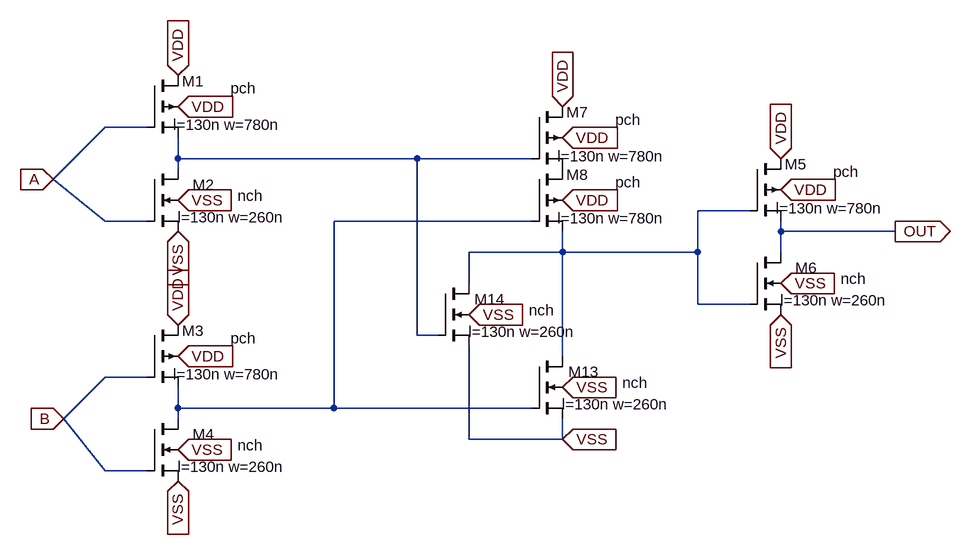
[diagram p0: schematic Or2.asc]
Or2.asc, the LTspice schematic file:
Version 4.1
SHEET 1 2700 680
WIRE 1440 -256 1376 -256
WIRE 1488 -208 1488 -240
WIRE 1856 -208 1488 -208
WIRE 2032 -208 1856 -208
WIRE 1488 -192 1488 -208
WIRE 1296 -176 1376 -256
WIRE 2368 -128 2288 -128
WIRE 1376 -112 1296 -176
WIRE 1440 -112 1376 -112
WIRE 2032 -112 1728 -112
WIRE 2416 -96 2416 -112
WIRE 2592 -96 2416 -96
WIRE 2080 -64 2080 -96
WIRE 2080 -64 1936 -64
WIRE 2288 -64 2288 -128
WIRE 2288 -64 2080 -64
WIRE 2416 -64 2416 -96
WIRE 1936 -16 1936 -64
WIRE 2288 16 2288 -64
WIRE 2368 16 2288 16
WIRE 1856 64 1856 -208
WIRE 1888 64 1856 64
WIRE 2080 96 2080 -64
WIRE 1440 128 1376 128
WIRE 1488 176 1488 144
WIRE 1728 176 1728 -112
WIRE 1728 176 1488 176
WIRE 2032 176 1728 176
WIRE 1312 192 1376 128
WIRE 1488 192 1488 176
WIRE 1936 224 1936 80
WIRE 2080 224 2080 192
WIRE 2080 224 1936 224
WIRE 1376 272 1312 192
WIRE 1440 272 1376 272
FLAG 1488 -336 VDD
IOPIN 1488 -336 In
FLAG 1488 -288 VDD
IOPIN 1488 -288 In
FLAG 2080 -288 VDD
IOPIN 2080 -288 In
FLAG 2080 -240 VDD
IOPIN 2080 -240 In
FLAG 2080 -144 VDD
IOPIN 2080 -144 In
FLAG 2416 -208 VDD
IOPIN 2416 -208 In
FLAG 2416 -160 VDD
IOPIN 2416 -160 In
FLAG 1488 48 VDD
IOPIN 1488 48 In
FLAG 1488 96 VDD
IOPIN 1488 96 In
FLAG 1488 -144 VSS
IOPIN 1488 -144 In
FLAG 1488 -96 VSS
IOPIN 1488 -96 In
FLAG 1488 240 VSS
IOPIN 1488 240 In
FLAG 1488 288 VSS
IOPIN 1488 288 In
FLAG 2080 144 VSS
IOPIN 2080 144 In
FLAG 2080 224 VSS
IOPIN 2080 224 In
FLAG 2416 -16 VSS
IOPIN 2416 -16 In
FLAG 2416 32 VSS
IOPIN 2416 32 In
FLAG 1936 32 VSS
IOPIN 1936 32 In
FLAG 1296 -176 A
IOPIN 1296 -176 In
FLAG 1312 192 B
IOPIN 1312 192 In
FLAG 2592 -96 OUT
IOPIN 2592 -96 Out
SYMBOL pmos4 1440 -336 R0
WINDOW 0 88 9 Right 2
WINDOW 3 168 20 Right 2
WINDOW 123 206 76 Right 2
SYMATTR InstName M1
SYMATTR Value pch
SYMATTR Value2 l=130n w=780n
SYMBOL nmos4 1440 -192 R0
WINDOW 0 104 24 Right 2
WINDOW 3 179 41 Right 2
WINDOW 123 213 74 Right 2
SYMATTR InstName M2
SYMATTR Value nch
SYMATTR Value2 l=130n w=260n
SYMBOL pmos4 1440 48 R0
WINDOW 0 88 9 Right 2
WINDOW 3 168 20 Right 2
WINDOW 123 206 76 Right 2
SYMATTR InstName M3
SYMATTR Value pch
SYMATTR Value2 l=130n w=780n
SYMBOL nmos4 1440 192 R0
WINDOW 0 104 24 Right 2
WINDOW 3 179 41 Right 2
WINDOW 123 213 74 Right 2
SYMATTR InstName M4
SYMATTR Value nch
SYMATTR Value2 l=130n w=260n
SYMBOL pmos4 2368 -208 R0
WINDOW 0 88 9 Right 2
WINDOW 3 168 20 Right 2
WINDOW 123 206 76 Right 2
SYMATTR InstName M5
SYMATTR Value pch
SYMATTR Value2 l=130n w=780n
SYMBOL nmos4 2368 -64 R0
WINDOW 0 104 24 Right 2
WINDOW 3 179 41 Right 2
WINDOW 123 213 74 Right 2
SYMATTR InstName M6
SYMATTR Value nch
SYMATTR Value2 l=130n w=260n
SYMBOL pmos4 2032 -288 R0
WINDOW 0 88 9 Right 2
WINDOW 3 168 20 Right 2
WINDOW 123 206 76 Right 2
SYMATTR InstName M7
SYMATTR Value pch
SYMATTR Value2 l=130n w=780n
SYMBOL pmos4 2032 -192 R0
WINDOW 0 88 9 Right 2
WINDOW 3 168 20 Right 2
WINDOW 123 206 76 Right 2
SYMATTR InstName M8
SYMATTR Value pch
SYMATTR Value2 l=130n w=780n
SYMBOL nmos4 2032 96 R0
WINDOW 0 104 24 Right 2
WINDOW 3 179 41 Right 2
WINDOW 123 213 74 Right 2
SYMATTR InstName M13
SYMATTR Value nch
SYMATTR Value2 l=130n w=260n
SYMBOL nmos4 1888 -16 R0
WINDOW 0 104 24 Right 2
WINDOW 3 179 41 Right 2
WINDOW 123 213 74 Right 2
SYMATTR InstName M14
SYMATTR Value nch
SYMATTR Value2 l=130n w=260n

The netlist it stands for:
* Or2.asc
M1 VDD A N001 VDD pch l=130n w=780n
M2 N001 A VSS VSS nch l=130n w=260n
M3 VDD B N003 VDD pch l=130n w=780n
M4 N003 B VSS VSS nch l=130n w=260n
M5 VDD N002 OUT VDD pch l=130n w=780n
M6 OUT N002 VSS VSS nch l=130n w=260n
M7 VDD N001 P001 VDD pch l=130n w=780n
M8 P001 N003 N002 VDD pch l=130n w=780n
M13 N002 N003 VSS VSS nch l=130n w=260n
M14 N002 N001 VSS VSS nch l=130n w=260n
.model NMOS NMOS
.model PMOS PMOS
.lib standard.mos
.backanno
.end